# Altium schematic sheet Analog.SchDoc
size A4; SheetNumber: 4; SheetTotal: 4
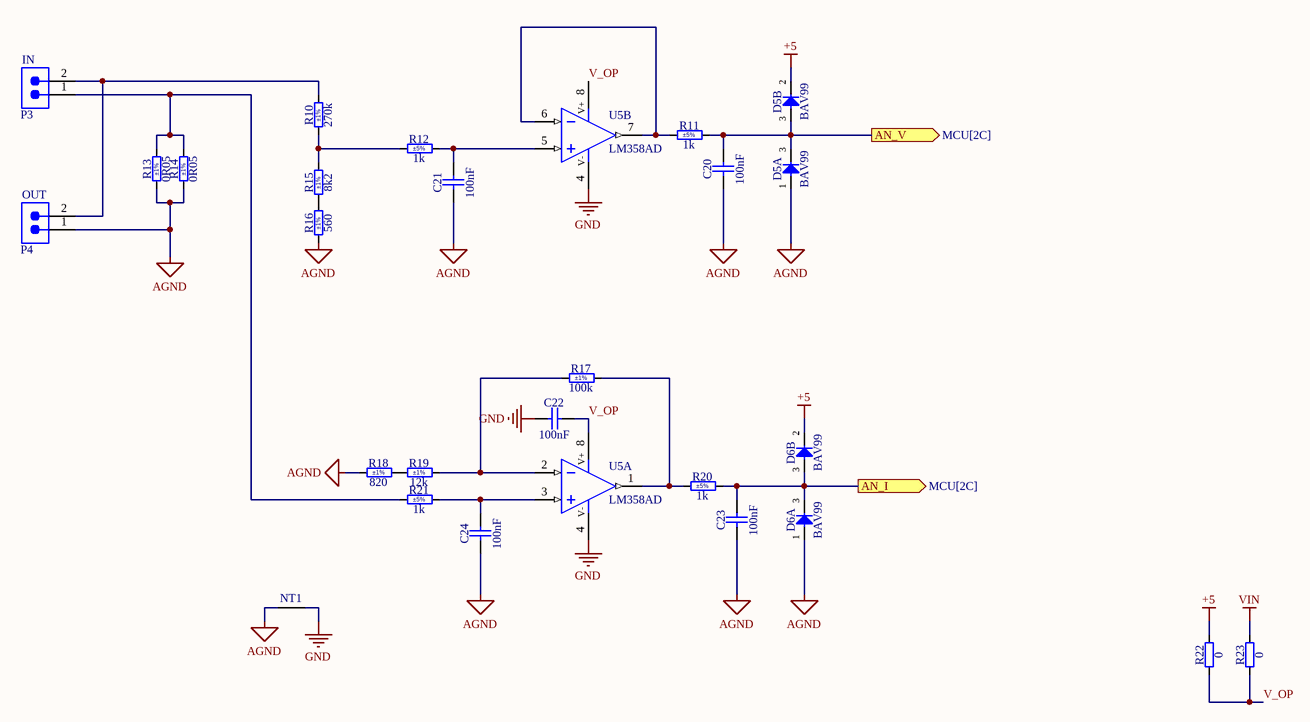
[diagram p0: Analog.SchDoc]

## Parts
C20  100nF  [CAPC2012X135N]
C21  100nF  [CAPC2012X135N]
C22  100nF  [CAPC2012X135N]
C23  100nF  [CAPC2012X135N]
C24  100nF  [CAPC2012X135N]
D5  BAV99  [SOT95P240X110-3N]  (parts A,B of 2)
D6  BAV99  [SOT95P240X110-3N]  (parts A,B of 2)
NT1  (no value)  [NET-TIE]  (net tie, no BOM)
P3  691322310002  [691322310002]  (value not drawn)
P4  691322310002  [691322310002]  (value not drawn)
R10  270k  Tolerance: ±1%  [RESC2012X60N]
R11  1k  Tolerance: ±5%  [RESC2012X60N]
R12  1k  Tolerance: ±5%  [RESC2012X60N]
R13  0R05  Tolerance: ±1%  [RESC_VISHAY_WSL2512_0R007-0R5]
R14  0R05  Tolerance: ±1%  [RESC_VISHAY_WSL2512_0R007-0R5]
R15  8k2  Tolerance: ±1%  [RESC2012X60N]
R16  560  Tolerance: ±1%  [RESC2012X60N]
R17  100k  Tolerance: ±1%  [RESC2012X60N]
R18  820  Tolerance: ±1%  [RESC2012X60N]
R19  12k  Tolerance: ±1%  [RESC2012X60N]
R20  1k  Tolerance: ±5%  [RESC2012X60N]
R21  1k  Tolerance: ±5%  [RESC2012X60N]
R22  0  [RESC2012X60N]
R23  0  [RESC2012X60N]
U5  LM358AD  [SOIC127P600X175-8N]  (parts A,B of 2)

## Ports
AN_I (out, see MCU[2C]), AN_V (out, see MCU[2C])

## Nets
+5: D5.2(C) D6.2(C) R22.2
AGND: C20.1 C21.1 C23.1 C24.1 D5.1(A) D6.1(A) NT1.1 P4.1 R13.1 R14.1 R16.1 R18.1
GND: C22.1 NT1.2 U5.4(V-)
VIN: R23.2
AN_I: C23.2 D6.3(COMAC) R20.2 ; port AN_I
AN_V: C20.2 D5.3(COMAC) R11.2 ; port AN_V
V_OP: C22.2 R22.1 R23.1 U5.8(V+)
NetC21_2: C21.2 R12.2 U5.5(IN+)
NetC24_2: C24.2 R21.2 U5.3(IN+)
NetP3_1: P3.1 R13.2 R14.2 R21.1
NetP3_2: P3.2 P4.2 R10.2
NetR10_1: R10.1 R12.1 R15.2
NetR11_1: R11.1 U5.6(IN-) U5.7(OUT)
NetR15_1: R15.1 R16.2
NetR17_1: R17.1 R19.2 U5.2(IN-)
NetR17_2: R17.2 R20.1 U5.1(OUT)
NetR18_2: R18.2 R19.1

## Notes on the sheet
- (near P3) IN
- (near P4) OUT

## Library data of the parts
C20-C24 = CC0805_100NF_50V_10%_X7R: Non-polarised capacitor; Part Description: SMD Multilayer Chip Ceramic Capacitor; Manufacturer: GENERIC; Manufacturer1 Part Number: C2012X7R1H104K085; Voltage: 50V; TC: X7R; Tolerance: ±10%; Part Number: CC0805_100NF_50V_10%_X7R; Component Kind: Standard; Component Type: Standard; Pin Count: 2; Value: 100nF; Status: None; Manufacturer Part Number: CC0805_100NF_50V_10%_X7R; Case: 0805; Mounted: Yes; Socket: No; SMD: Yes; Sense: No; Manufacturer1 Example: TDK; Manufacturer1 ComponentHeight: 1mm; HelpURL: \\cern.ch\dfs\Applications\Altium\Datasheets\CC0805_X7R_TDK_C.pdf; Author: CERN DEM JLC; CreateDate: 3.12.2007; LatestRevisionDate: 22.04.2015
D5 D6 = BAV99: Serial Diode; Part Description: Dual Series Signal Diode; Manufacturer: FAIRCHILD SEMICONDUCTOR; Voltage: 70V; Power: 350mW; PressFit: No; Bonding: No; Part Number: BAV99; Component Kind: Standard; Component Type: Standard; Device: BAV99; PackageDescription: SOT, 0.95mm Pitch; 3 Pin, 1.40mm W X 3.00mm L X 1.10mm H body, IPC Medium Density; Manufacturer Part Number: BAV99; Pin Count: 3; Case: SOT23-3; Mounted: Yes; Socket: No; SMD: Yes; Sense: No; ComponentHeight: 1.1mm; HelpURL: \\cern.ch\dfs\Applications\Altium\Datasheets\BAV99.pdf; Author: CERN DEM JLC; CreateDate: 6.05.2008; LatestRevisionDate: 27.09.2012
NT1 = Net Tie
P3 P4 = 691322310002: WR-TBL Series 322 Horizontal PCB Header, THT, pitch 3.81mm, 2p; Manufacturer: Wurth Elektronik; Modularity: No; Rated Current: 10A; Working Voltage: 300V; Manufacturer Part Number: 691322310002; Category: Terminal Blocks; Match Code: WR-TBL; ComponentLink1Description: Website Link; ComponentLink1URL: https://www.we-online.com/redexpert/article/691322310002?ad; ComponentLink2Description: Datasheet Link; ComponentLink2URL: https://www.we-online.com/redexpert/spec/691322310002?ad; Mount: Through Hole; Operating Temperature Max: 105°C; Operating Temperature Min: -40°C; Packaging: Box; Application: Pluggable; Number of Pins: 2; Number of Rows: 1; Orientation: Horizontal; Pitch: 3.81mm
R10 = R0805_270K_1%_0.125W_100PPM: Resistor - 1%; Part Description: General Purpose Thick Film Chip Resistor; Manufacturer: GENERIC; Manufacturer1 Part Number: NRC10F2703TRF; Power: 0.125W; TC: ±100ppm/°C; PressFit: No; Part Number: R0805_270K_1%_0.125W_100PPM; Component Kind: Standard; Component Type: Standard; Pin Count: 2; Value: 270k; Status: Preferred; Manufacturer Part Number: R0805_270K_1%_0.125W_100PPM; Case: 0805; Mounted: Yes; Sense: No; Socket: No; SMD: Yes; Manufacturer1 Example: NIC COMPONENT; Manufacturer1 ComponentHeight: 0.6mm; HelpURL: \\cern.ch\dfs\Applications\Altium\Datasheets\R0805_NIC_NRC.pdf; Author: CERN DEM JLC; CreateDate: 3.12.2007; LatestRevisionDate: 13.03.2008
R11 R12 R20 R21 = R0805_1K_1%_0.125W_100PPM: Resistor - 5%; Part Number: R0805_1K_5%_0.125W_100PPM; Part Description: General Purpose Thick Film Chip Resistor; Manufacturer: GENERIC; Manufacturer1 Part Number: NRC10F1001TRF; Power: 0.125W; TC: ±100ppm/°C; PressFit: No; Component Kind: Standard; Component Type: Standard; Pin Count: 2; Value: 1k; Status: Preferred; Manufacturer Part Number: R0805_1K_5%_0.125W_100PPM; Case: 0805; Mounted: Yes; Sense: No; Socket: No; SMD: Yes; Manufacturer1 Example: NIC COMPONENT; Manufacturer1 ComponentHeight: 0.6mm; HelpURL: \\cern.ch\dfs\Applications\Altium\Datasheets\R0805_NIC_NRC.pdf; Author: CERN DEM JLC; CreateDate: 3.12.2007; LatestRevisionDate: 13.03.2008
R13 R14 = R2512_0R05_1%_1W_75PPM_VISHAY_WSL: Resistor - 1%; Part Description: Power Metal Strip® Resistor; Manufacturer: VISHAY DALE; Manufacturer Part Number: WSL2512R0500FEA; Power: 1W; TC: ±75ppm/°C; PressFit: No; Part Number: R2512_0R05_1%_1W_75PPM_VISHAY_WSL; Component Kind: Standard; Component Type: Standard; Pin Count: 2; Value: 0R05; Status: None; Case: 2512; Mounted: Yes; Sense: No; Socket: No; SMD: Yes; ComponentHeight: 0.89mm; HelpURL: \\cern.ch\dfs\Applications\Altium\Datasheets\R2512_VISHAY_WSL.pdf; Author: CERN DEM BC; CreateDate: 11.11.2020; LatestRevisionDate: 11.11.2020
R15 = R0805_8K2_1%_0.125W_100PPM: Resistor - 1%; Part Description: General Purpose Thick Film Chip Resistor; Manufacturer: GENERIC; Manufacturer1 Part Number: NRC10F8201TRF; Power: 0.125W; TC: ±100ppm/°C; PressFit: No; Part Number: R0805_8K2_1%_0.125W_100PPM; Component Kind: Standard; Component Type: Standard; Pin Count: 2; Value: 8k2; Status: Preferred; Manufacturer Part Number: R0805_8K2_1%_0.125W_100PPM; Case: 0805; Mounted: Yes; Sense: No; Socket: No; SMD: Yes; Manufacturer1 Example: NIC COMPONENT; Manufacturer1 ComponentHeight: 0.6mm; HelpURL: \\cern.ch\dfs\Applications\Altium\Datasheets\R0805_NIC_NRC.pdf; Author: CERN DEM JLC; CreateDate: 3.12.2007; LatestRevisionDate: 13.03.2008
R16 = R0805_560R_1%_0.125W_100PPM: Resistor - 1%; Part Description: General Purpose Thick Film Chip Resistor; Manufacturer: GENERIC; Manufacturer1 Part Number: NRC10F5600TRF; Power: 0.125W; TC: ±100ppm/°C; PressFit: No; Part Number: R0805_560R_1%_0.125W_100PPM; Component Kind: Standard; Component Type: Standard; Pin Count: 2; Value: 560; Status: Preferred; Manufacturer Part Number: R0805_560R_1%_0.125W_100PPM; Case: 0805; Mounted: Yes; Sense: No; Socket: No; SMD: Yes; Manufacturer1 Example: NIC COMPONENT; Manufacturer1 ComponentHeight: 0.6mm; HelpURL: \\cern.ch\dfs\Applications\Altium\Datasheets\R0805_NIC_NRC.pdf; Author: CERN DEM JLC; CreateDate: 3.12.2007; LatestRevisionDate: 13.03.2008
R17 = R0805_100K_1%_0.125W_100PPM: Resistor - 1%; Part Description: General Purpose Thick Film Chip Resistor; Manufacturer: GENERIC; Manufacturer1 Part Number: NRC10F1003TRF; Power: 0.125W; TC: ±100ppm/°C; PressFit: No; Part Number: R0805_100K_1%_0.125W_100PPM; Component Kind: Standard; Component Type: Standard; Pin Count: 2; Value: 100k; Status: Preferred; Manufacturer Part Number: R0805_100K_1%_0.125W_100PPM; Case: 0805; Mounted: Yes; Sense: No; Socket: No; SMD: Yes; Manufacturer1 Example: NIC COMPONENT; Manufacturer1 ComponentHeight: 0.6mm; HelpURL: \\cern.ch\dfs\Applications\Altium\Datasheets\R0805_NIC_NRC.pdf; Author: CERN DEM JLC; CreateDate: 3.12.2007; LatestRevisionDate: 13.03.2008
R18 = R0805_820R_1%_0.125W_100PPM: Resistor - 1%; Part Description: General Purpose Thick Film Chip Resistor; Manufacturer: GENERIC; Manufacturer1 Part Number: NRC10F8200TRF; Power: 0.125W; TC: ±100ppm/°C; PressFit: No; Part Number: R0805_820R_1%_0.125W_100PPM; Component Kind: Standard; Component Type: Standard; Pin Count: 2; Value: 820; Status: Preferred; Manufacturer Part Number: R0805_820R_1%_0.125W_100PPM; Case: 0805; Mounted: Yes; Sense: No; Socket: No; SMD: Yes; Manufacturer1 Example: NIC COMPONENT; Manufacturer1 ComponentHeight: 0.6mm; HelpURL: \\cern.ch\dfs\Applications\Altium\Datasheets\R0805_NIC_NRC.pdf; Author: CERN DEM JLC; CreateDate: 3.12.2007; LatestRevisionDate: 13.03.2008
R19 = R0805_12K_1%_0.125W_100PPM: Resistor - 1%; Part Description: General Purpose Thick Film Chip Resistor; Manufacturer: GENERIC; Manufacturer1 Part Number: NRC10F1202TRF; Power: 0.125W; TC: ±100ppm/°C; PressFit: No; Part Number: R0805_12K_1%_0.125W_100PPM; Component Kind: Standard; Component Type: Standard; Pin Count: 2; Value: 12k; Status: Preferred; Manufacturer Part Number: R0805_12K_1%_0.125W_100PPM; Case: 0805; Mounted: Yes; Sense: No; Socket: No; SMD: Yes; Manufacturer1 Example: NIC COMPONENT; Manufacturer1 ComponentHeight: 0.6mm; HelpURL: \\cern.ch\dfs\Applications\Altium\Datasheets\R0805_NIC_NRC.pdf; Author: CERN DEM JLC; CreateDate: 3.12.2007; LatestRevisionDate: 13.03.2008
R22 R23 = R0805_0R_JUMPER: Resistor; Part Description: 2A (0.05R Max DC Resistance) Zero Ohm Jumper; Manufacturer: GENERIC; Manufacturer1 Part Number: NRC10Z0; PressFit: No; Part Number: R0805_0R_JUMPER; Component Kind: Standard; Component Type: Standard; Pin Count: 2; Value: 0; Status: Preferred; Manufacturer Part Number: R0805_0R_JUMPER; Case: 0805; Mounted: Yes; Sense: No; Socket: No; SMD: Yes; Manufacturer1 Example: NIC COMPONENT; Manufacturer1 ComponentHeight: 0.6mm; HelpURL: \\cern.ch\dfs\Applications\Altium\Datasheets\R0805_NIC_NRC.pdf; Author: CERN DEM JLC; CreateDate: 3.12.2007; LatestRevisionDate: 13.03.2008
U5 = LM358AD: Dual Operational Amplifier; Part Description: Dual Operational Amplifier, Vos=3mV, Iq/CH=350uA, 0°C to 70°C; Manufacturer: TEXAS INSTRUMENTS; PressFit: No; Bonding: No; Part Number: LM358AD; Component Kind: Standard; Component Type: Standard; Device: LM358AD; PackageDescription: SOIC 8, Pitch 1.27mm - Body 4x5mm, IPC Medium Density; Manufacturer Part Number: LM358AD; Pin Count: 8; Case: SOIC8; Mounted: Yes; Socket: No; SMD: Yes; Sense: No; ComponentHeight: 1.75mm; Author: CERN DEM JLC; HelpURL: \\cern.ch\dfs\Applications\Altium\Datasheets\LM358A.pdf; CreateDate: 2.12.2008; LatestRevisionDate: 6.09.2021